# EasyEDA Pro project ProProject_MPU6050基座模块_2024-06-20.epro

# Schematic Schematic1
Create Date: 2024-06-10; Page Name: P1; Project Name: MPU6050基座模块; Schematic Name: Schematic1; Update Date: 2024-06-10; Company: 嘉立创EDA; Page Size: A4; Version: V1.0
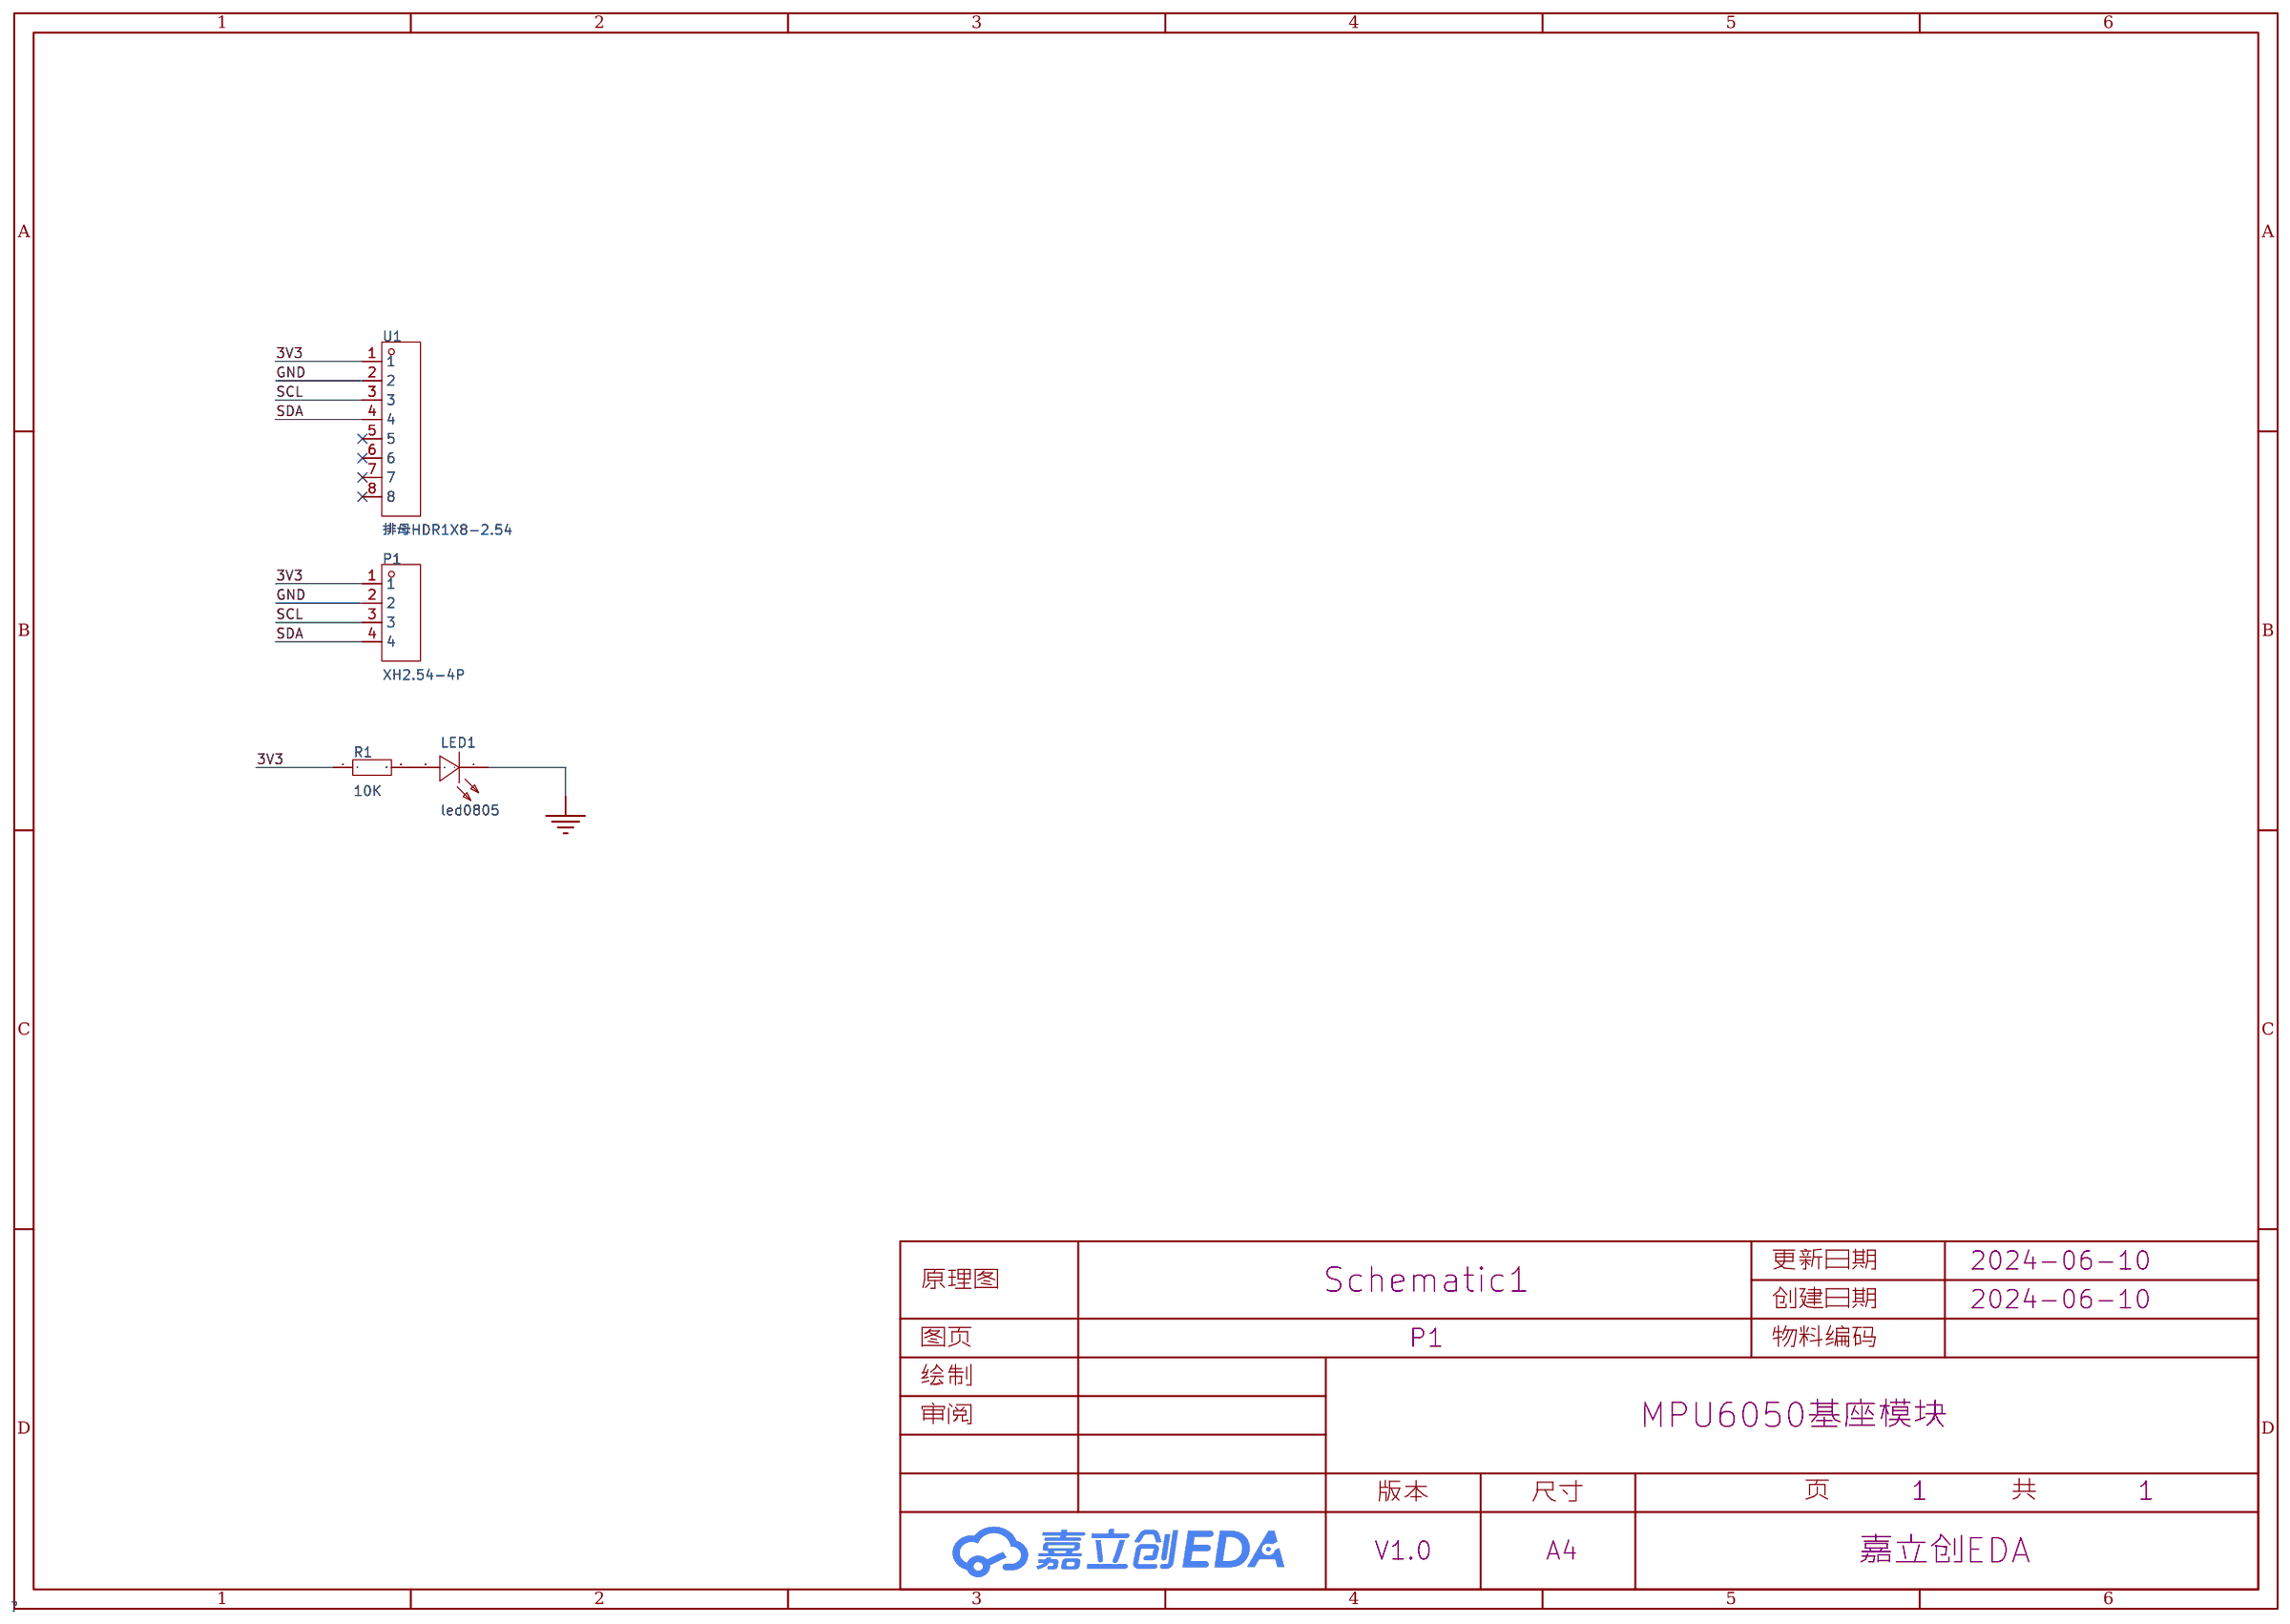
[diagram p0: schematic sheet]

## Parts
LED1  led0805  [LED0805-RD]
P1  XH2.54-4P  [CONN-TH_4P-P2.50-XH2.54-4P]
R1  10K  [R0603]
U1  排母HDR1X8-2.54  [HDR-TH_8P-P2.54-V-F]

## Library data of the parts
LED1 = led0805: Supplier Part: C9900012722; JLCPCB Part Class: 扩展库; Supplier: LCSC
P1 = XH2.54-4P_C9900003326: Supplier Part: C9900003326; JLCPCB Part Class: 扩展库; Supplier: LCSC
R1 = Res_0603: Supplier Footprint: 0603
U1 = 排母HDR1X8-2.54: Supplier Part: C9900015386; Supplier Footprint: HDR1X8-2.54; JLCPCB Part Class: Extended Part; Supplier: LCSC

## Nets
3V3: P1.1 R1.1 U1.1
GND: LED1.1(-) P1.2 U1.2
SCL: P1.3 U1.3
SDA: P1.4 U1.4
$1N354: LED1.2(+) R1.2

Not connected (* = marked no-connect by the designer): U1 5* 6* 7* 8*

# Board PCB1
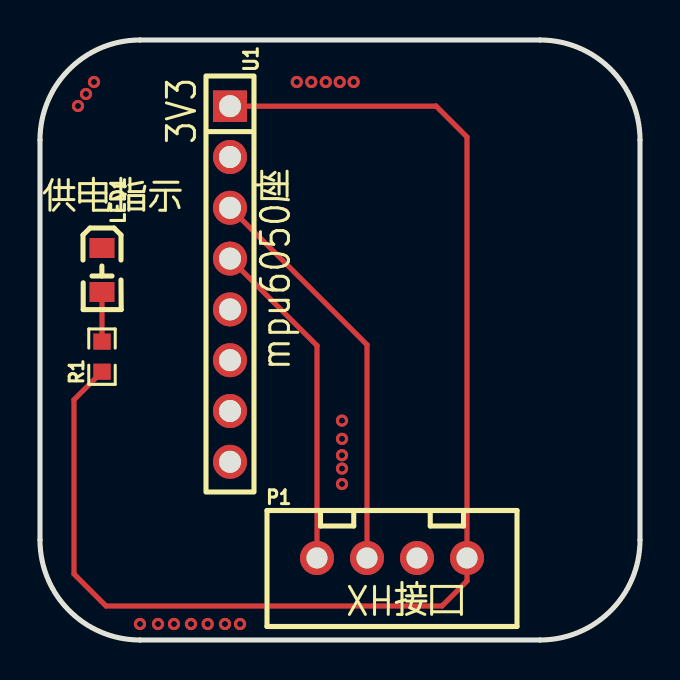
[diagram p1: board, top side]
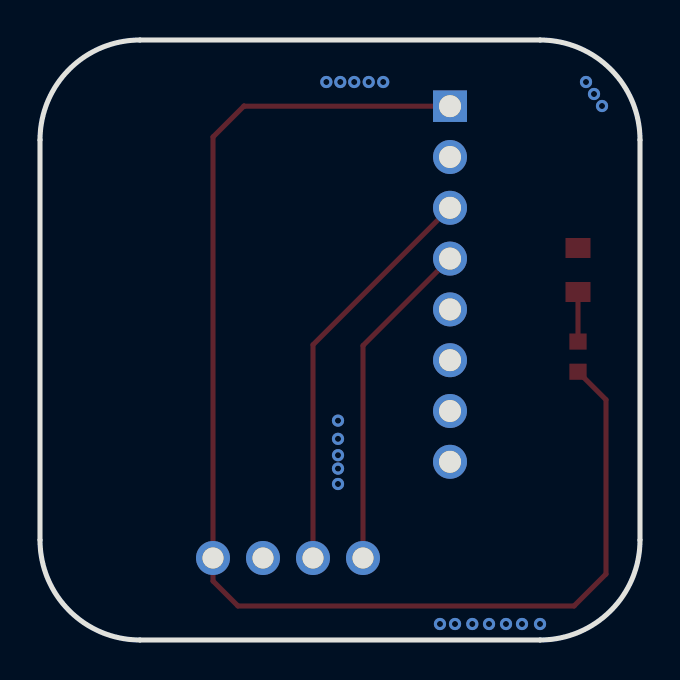
[diagram p2: board, bottom side, seen from below]

Outline 30 x 30 mm; copper layers: Top Layer, Bottom Layer. Coordinates in mm from the lower left corner of the outline.
Outline path: 0,25 0,5 arc(1.46,1.46) 5,0 25,0 arc(28.54,1.46) 30,5 30,25 arc(28.54,28.54) 25,30 5,30 arc(1.46,28.54) 0,25
Stack: Top Layer 0.035mm / Dielectric1 1.51mm FR4 er 4.5 / Bottom Layer 0.035mm

## Design rules (mm)
template: 自定义配置
spacing copperThickness1oz (default): track to track 0.102, other pairs 0.152 to 0.3
spacing copperThickness2oz: track to track 0.203, other pairs 0.152 to 0.3
track width copperThickness1oz (default): min 0.127, default 0.254, max 2.54
track width copperThickness2oz: min 0.203, default 0.254, max 2.54
differential pair differentialPair (default): width min 0.127, default 0.254, max 2.54; gap min 0.152, default 0.152
via viaSize (default): diameter min 0.5, default 0.61, max 10; hole min 0.3, default 0.305, max 6.3

## Placement (name value [footprint] x y rotation side)
LED1  led0805  [LED0805-RD]  3.1 18.5 270 top
P1  XH2.54-4P  [CONN-TH_4P-P2.50-XH2.54-4P]  17.6 4.1 0 top
R1  10K  [R0603]  3.1 14.17 90 top
U1  排母HDR1X8-2.54  [HDR-TH_8P-P2.54-V-F]  9.5 17.8 270 top

## Footprints (pads in the part's own frame, mm; a bottom-side part is the same pattern mirrored in y, then rotated)
CONN-TH_4P-P2.50-XH2.54-4P
  round 1.7 hole 1.05: 1(3.75,0) 2(1.25,0) 3(-1.25,0) 4(-3.75,0)
HDR-TH_8P-P2.54-V-F
  rect 1.575x1.7 hole 1.1: 1(-8.89,0)
  round 1.7 hole 1.1: 2(-6.35,0) 3(-3.81,0) 4(-1.27,0) 5(1.27,0) 6(3.81,0) 7(6.35,0) 8(8.89,0)
LED0805-RD
  rect 1x1.25 smd: 1(-1.1,0) 2(1.1,0)
R0603
  rect 0.806x0.864 smd: 1(-0.753,0) 2(0.753,0)

## Nets
As in the schematic.

Pads without a net: U1 5 6 7 8

## Via types
v1: diameter 0.61, hole 0.305, Top Layer to Bottom Layer, 20 vias

## Routing (per net, layer and track width the routed paths; a pad name or vN(x,y) marks a point on that pad's centre or on a via; arc(x,y) is an arc through that point)
3V3: length 66.2
  Top Layer w0.254: U1.1 19.79,26.69 19.8,26.7 21.35,25.15 P1.1 21.35,2.95 20.1,1.7 3.3,1.7 1.7,3.3 1.7,12.01 R1.1
GND:
  vias: v1(1.9,26.7) v1(2.3,27.3) v1(2.7,27.9) v1(5,0.8) v1(5.9,0.8) v1(6.7,0.8) v1(7.55,0.8) v1(8.38,0.8) v1(9.25,0.8) v1(10,0.8) v1(12.84,27.9) v1(13.56,27.9) v1(14.29,27.9) v1(14.99,27.9) v1(15.1,10.97) v1(15.1,10.06) v1(15.1,9.24) v1(15.1,8.57) v1(15.1,7.8) v1(15.68,27.9)
SCL: length 20.3
  Top Layer w0.254: P1.3 16.35,14.76 U1.3
SDA: length 16.8
  Top Layer w0.254: U1.4 13.85,14.72 P1.4
$1N354: length 2.5
  Top Layer w0.254: R1.2 LED1.2

## Copper pours and planes (outline as drawn; the poured copper is in the pictures)
GND on Top Layer: -1.7,34.3 33.4,34.3 33.4,-3.8 -1.7,-3.8
GND on Bottom Layer: -0.1,32.8 31.3,32.8 31.3,-1.3 -0.1,-1.3

## Text on the board
Top Silkscreen Layer: 3V3 | 供电指示 | XH接口 | mpu6050座
